# Altium project 2011_bms_slave.PrjPcb
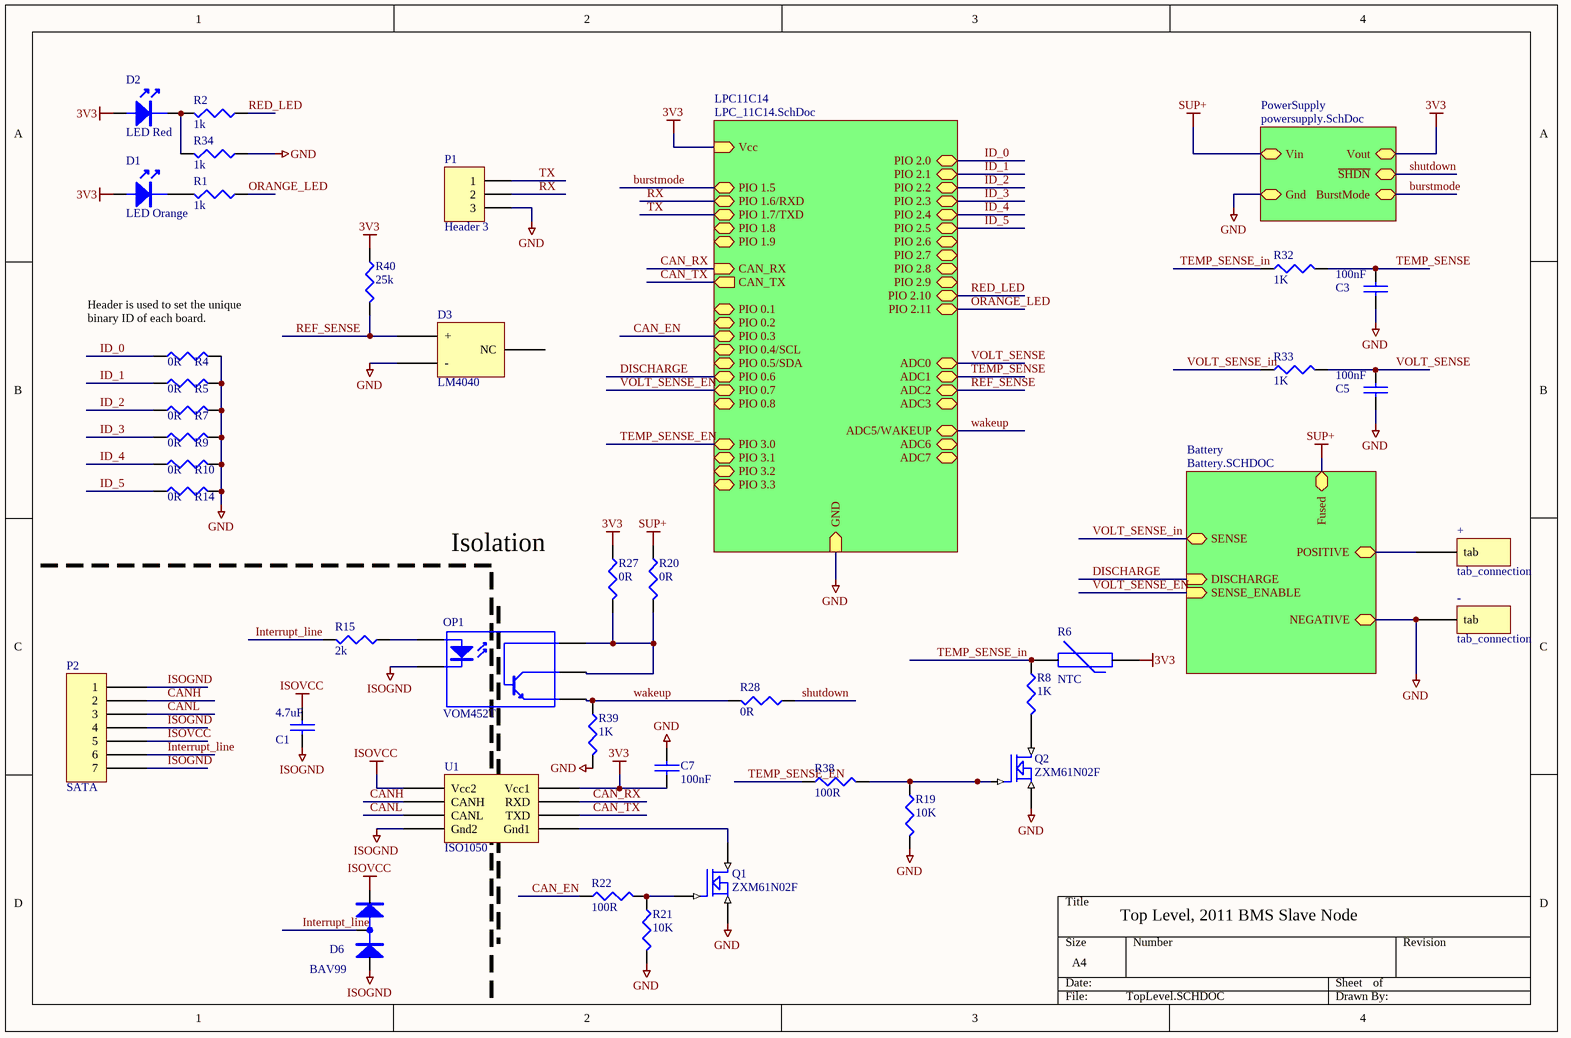
[diagram p0: TopLevel.SCHDOC]
4 sheets, 77 parts. Net scope: hierarchical (ports join the sheet entries above them; power ports are global).
Board file: 2011_bms_slave_board.PcbDoc
Sheets:
  TopLevel.SCHDOC
    Battery = Battery.SCHDOC
    LPC11C14 = LPC_11C14.SchDoc
    PowerSupply = powersupply.SchDoc

## Sheet TopLevel.SCHDOC
size A4

### Parts
+  tab_connection  [tab_connect]
-  tab_connection  [tab_connect]
C1  4.7uF  [0805]
C3  100nF  [0603]
C5  100nF  [0603]
C7  100nF  [0603]
D1  LED Orange  [0603_LED]
D2  LED Red  [0603_LED]
D3  LM4040  [SOT23-3]
D6  BAV99  [BAV99]
OP1  VOM452T  [VOM452T]
P1  Header 3  [HDR1X3]
P2  SATA  [47080-4005-SATA]
Q1  ZXM61N02F  [SOT23-3]
Q2  ZXM61N02F  [SOT23-3]
R1  1k  [0603]
R2  1k  [0603]
R4  0R  [0603]
R5  0R  [0603]
R6  NTC  [MHDR1X2]
R7  0R  [0603]
R8  1K  [0603]
R9  0R  [0603]
R10  0R  [0603]
R14  0R  [0603]
R15  2k  [0603]
R19  10K  [0603]
R20  0R  [0603]
R21  10K  [0603]
R22  100R  [0603]
R27  0R  [0603]
R28  0R  [0603]
R32  1K  [0603]
R33  1K  [0603]
R34  1k  [0603]
R38  100R  [0603]
R39  1K  [0603]
R40  25k  [0603]
U1  ISO1050  [SOP8]

### Sub-sheets
Battery = Battery.SCHDOC: DISCHARGE (in), SENSE_ENABLE (in), SENSE (bidir), Fused, POSITIVE, NEGATIVE
LPC11C14 = LPC_11C14.SchDoc: ADC5/WAKEUP (bidir), ADC6 (bidir), CAN_TX (out), CAN_RX (in), ADC7, Vcc (in), GND (in), ADC3 (bidir), ADC2 (bidir), ADC1 (bidir), ADC0 (bidir), PIO 0.4/SCL (bidir), PIO 0.5/SDA (bidir), PIO 0.7 (bidir), PIO 0.6 (bidir), PIO 0.1 (bidir), PIO 0.2, PIO 0.3, PIO 0.8, PIO 1.6/RXD (bidir), PIO 1.7/TXD (bidir), PIO 1.5, PIO 1.8, PIO 1.9, PIO 3.0 (bidir), PIO 3.1 (bidir), PIO 3.2, PIO 3.3, PIO 2.9 (bidir), PIO 2.8 (bidir), PIO 2.7 (bidir), PIO 2.11 (bidir), PIO 2.10 (bidir), PIO 2.3 (bidir), PIO 2.2 (bidir), PIO 2.1 (bidir), PIO 2.6, PIO 2.0, PIO 2.4, PIO 2.5
PowerSupply = powersupply.SchDoc: Vin, Vout, Gnd, BurstMode, ~{SHDN}

### Nets
3V3: C7.1 D1.A D2.A R6.2 R27.1 R40.1 U1.1(Vcc1) ; sheet LPC11C14/Vcc, sheet PowerSupply/Vout
GND: -.0(tab) C3.2 C5.2 C7.2 D3.2(-) P1.3 Q1.2(S) Q2.2(S) R4.2 R5.2 R7.2 R9.2 R10.2 R14.2 R19.2 R21.2 R34.1 R39.2 ; sheet Battery/NEGATIVE, sheet LPC11C14/GND, sheet PowerSupply/Gnd
ISOGND: C1.2 D6.A OP1.3(K) P2.1 P2.4 P2.7 U1.5(Gnd2)
ISOVCC: C1.1 D6.K P2.5 U1.8(Vcc2)
SUP+: R20.1 ; sheet Battery/Fused, sheet PowerSupply/Vin
burstmode: sheet LPC11C14/PIO 1.5, sheet PowerSupply/BurstMode
CAN_EN: R22.1 ; sheet LPC11C14/PIO 0.3
CAN_RX: U1.2(RXD) ; sheet LPC11C14/CAN_RX
CAN_TX: U1.3(TXD) ; sheet LPC11C14/CAN_TX
CANH: P2.2 U1.7(CANH)
CANL: P2.3 U1.6(CANL)
DISCHARGE: sheet Battery/DISCHARGE, sheet LPC11C14/PIO 0.6
ID_0: R4.1 ; sheet LPC11C14/PIO 2.0
ID_1: R5.1 ; sheet LPC11C14/PIO 2.1
ID_2: R7.1 ; sheet LPC11C14/PIO 2.2
ID_3: R9.1 ; sheet LPC11C14/PIO 2.3
ID_4: R10.1 ; sheet LPC11C14/PIO 2.4
ID_5: R14.1 ; sheet LPC11C14/PIO 2.5
Interrupt_line: D6.C P2.6 R15.2
ORANGE_LED: R1.1 ; sheet LPC11C14/PIO 2.11
RED_LED: R2.1 ; sheet LPC11C14/PIO 2.10
REF_SENSE: D3.1(+) R40.2 ; sheet LPC11C14/ADC2
RX: P1.2 ; sheet LPC11C14/PIO 1.6/RXD
shutdown: R28.1 ; sheet PowerSupply/~{SHDN}
TEMP_SENSE: C3.1 R32.2 ; sheet LPC11C14/ADC1
TEMP_SENSE_EN: R38.1 ; sheet LPC11C14/PIO 3.0
TEMP_SENSE_in: R6.1 R8.1 R32.1
TX: P1.1 ; sheet LPC11C14/PIO 1.7/TXD
VOLT_SENSE: C5.1 R33.2 ; sheet LPC11C14/ADC0
VOLT_SENSE_EN: sheet Battery/SENSE_ENABLE, sheet LPC11C14/PIO 0.7
VOLT_SENSE_in: R33.1 ; sheet Battery/SENSE
wakeup: OP1.4(E) R28.2 R39.1 ; sheet LPC11C14/ADC5/WAKEUP
Net+_0: +.0(tab) ; sheet Battery/POSITIVE
NetD1_K: D1.K R1.2
NetD2_K: D2.K R2.2 R34.2
NetOP1_1: OP1.1(A) R15.1
NetOP1_5: OP1.5(C) OP1.6(C) R20.2 R27.2
NetQ1_1: Q1.1(G) R21.1 R22.2
NetQ1_3: Q1.3(D) U1.4(Gnd1)
NetQ2_1: Q2.1(G) R19.1 R38.2
NetQ2_3: Q2.3(D) R8.2

Not connected (* = marked no-connect by the designer): D3 3(NC)

### Notes on the sheet
- (near R4) Header is used to set the unique binary ID of each board.
- (near R27) Isolation
- Top Level, 2011 BMS Slave Node

### Library data of the parts
C1 = CAP: Capacitor; Value: 100nF; Needed?: NO - HW LAB
C3 C5 C7 = CAP: Capacitor; Needed?: NO - HW LAB; Value: 100nF
D1 = LED: Order#: 3225148; Price: 0.99; Supplier: Farnell
D2 = LED: Order#: 5790840; Price: 0.385; Supplier: Farnell
D6 = DIODE SERIES 2: diode, series connected; Order#: 741-000; Price: 0.223; Supplier: Farnell
P1 = Header 3: Header, 3-Pin; LatestRevisionDate: 17-Jul-2002; LatestRevisionNote: Re-released for DXP Platform.; Publisher: Altium Limited
Q1 Q2 = ZXM61N02F: 1.7A, 20V N-Channel Enhancement mode FET; Order#: 9525270; Price: 0.803; Supplier: Farnell
R1 R2 R4 R5 R7 R9 R10 R14 R19 R21 R22 R34 R38 = RES1: Resistor; Order#: 9233253; Price: 0.088; Supplier: Farnell
R6 = NTC: Thermistor, NTC; Order#: 1187036; Supplier: Farnell; Price: 2.23
R8 R15 R20 R27 R28 R32 R33 R39 R40 = RES1: Resistor; Order#: 9330380; Supplier: Farnell; Price: 0.066

## Sheet Battery.SCHDOC
size A4
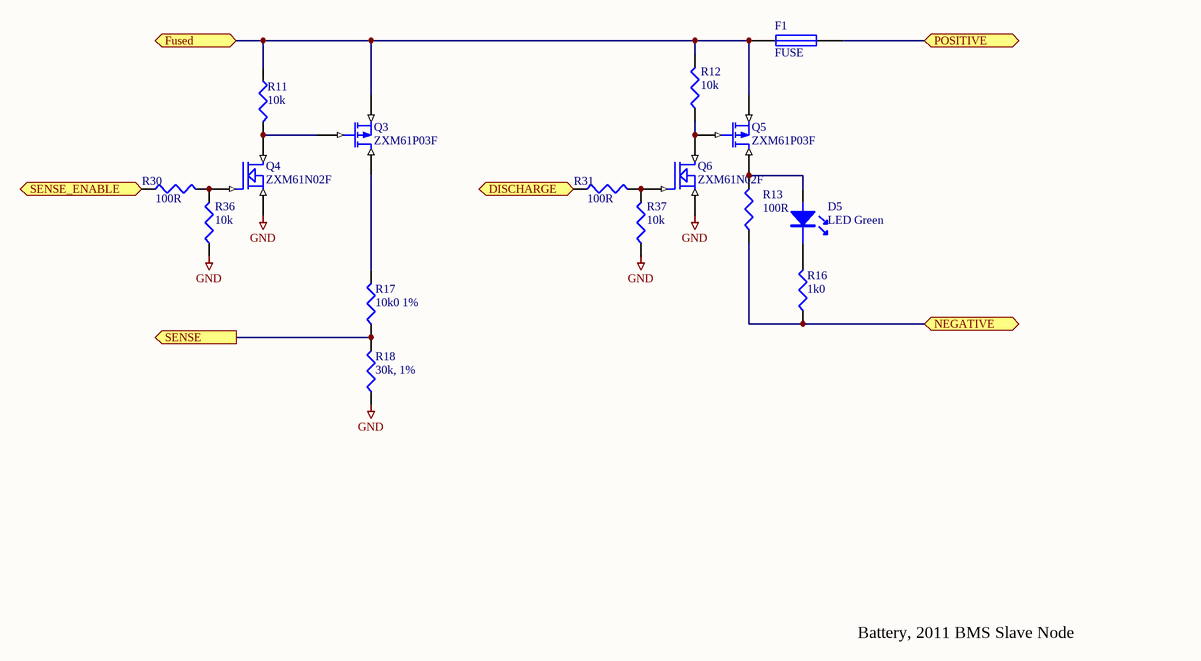
[diagram p1: Battery.SCHDOC]

### Parts
D5  LED Green  [0603_LED]
F1  FUSE  [LITTELFUSE-154]
Q3  ZXM61P03F  [SOT23-3]
Q4  ZXM61N02F  [SOT23-3]
Q5  ZXM61P03F  [SOT23-3]
Q6  ZXM61N02F  [SOT23-3]
R11  10k  [0603]
R12  10k  [0603]
R13  100R  [AXIAL-0.3]  (value not drawn)
R16  1k0  [0603]
R17  10k0 1%  [0603]
R18  30k, 1%  [0603]
R30  100R  [0603]
R31  100R  [0603]
R36  10k  [0603]
R37  10k  [0603]

### Ports
DISCHARGE (in), Fused, NEGATIVE (bidir), POSITIVE (bidir), SENSE (out), SENSE_ENABLE (in)

### Nets
GND: Q4.2(S) Q6.2(S) R13.1 R16.1 R18.1 R36.1 R37.1 ; port NEGATIVE
SUP+: F1.1 Q3.2(D) Q5.2(D) R11.1 R12.2 ; port Fused
DISCHARGE: R31.1 ; port DISCHARGE
VOLT_SENSE_EN: R30.1 ; port SENSE_ENABLE
VOLT_SENSE_in: R17.1 R18.2 ; port SENSE
Net+_0: F1.2 ; port POSITIVE
NetD5_A: D5.A Q5.3(S) R13.2
NetD5_K: D5.K R16.2
NetQ3_1: Q3.1(G) Q4.3(D) R11.2
NetQ3_3: Q3.3(S) R17.2
NetQ4_1: Q4.1(G) R30.2 R36.2
NetQ5_1: Q5.1(G) Q6.3(D) R12.1
NetQ6_1: Q6.1(G) R31.2 R37.2

### Notes on the sheet
- Battery, 2011 BMS Slave Node

### Library data of the parts
D5 = LED: HSMG-C170, Green LED; Order#: 5790852; Price: 0.462; Supplier: Farnell
F1 = FUSE: Order#: 9943625; Supplier: Farnell; Price: 5.25
Q3 Q5 = ZXM61P03F: 1.1A, 30V P-Channel Enhancement mode FET; Order#: 9525300; Price: 0.825; Supplier: Farnell
Q4 Q6 = ZXM61N02F: as Q1 on sheet TopLevel; Price: 0.803; Supplier: Farnell
R11 R12 R18 = RES1: Resistor; Order#: 9330399; Price: 0.066; Supplier: Farnell
R13 = RES1: Resistor, 100R, 1W, 10V; Order#: 1107496; Price: 2.45; Supplier: Farnell
R16 = RES1: Resistor; Order#: 9330380; Price: 0.066; Supplier: Farnell
R17 = RES1: Resistor; Order#: 9330771; Price: 0.066; Supplier: Farnell
R30 R31 R36 R37 = RES1: Resistor; Order#: 9233253; Price: 0.088; Supplier: Farnell

## Sheet LPC_11C14.SchDoc
size A4; Organization: UNSW Solar Racing Team; Address3: UNSW; Address4: Sydney NSW 2052; Address2: Electrical Engineering; Address1: Rm 109
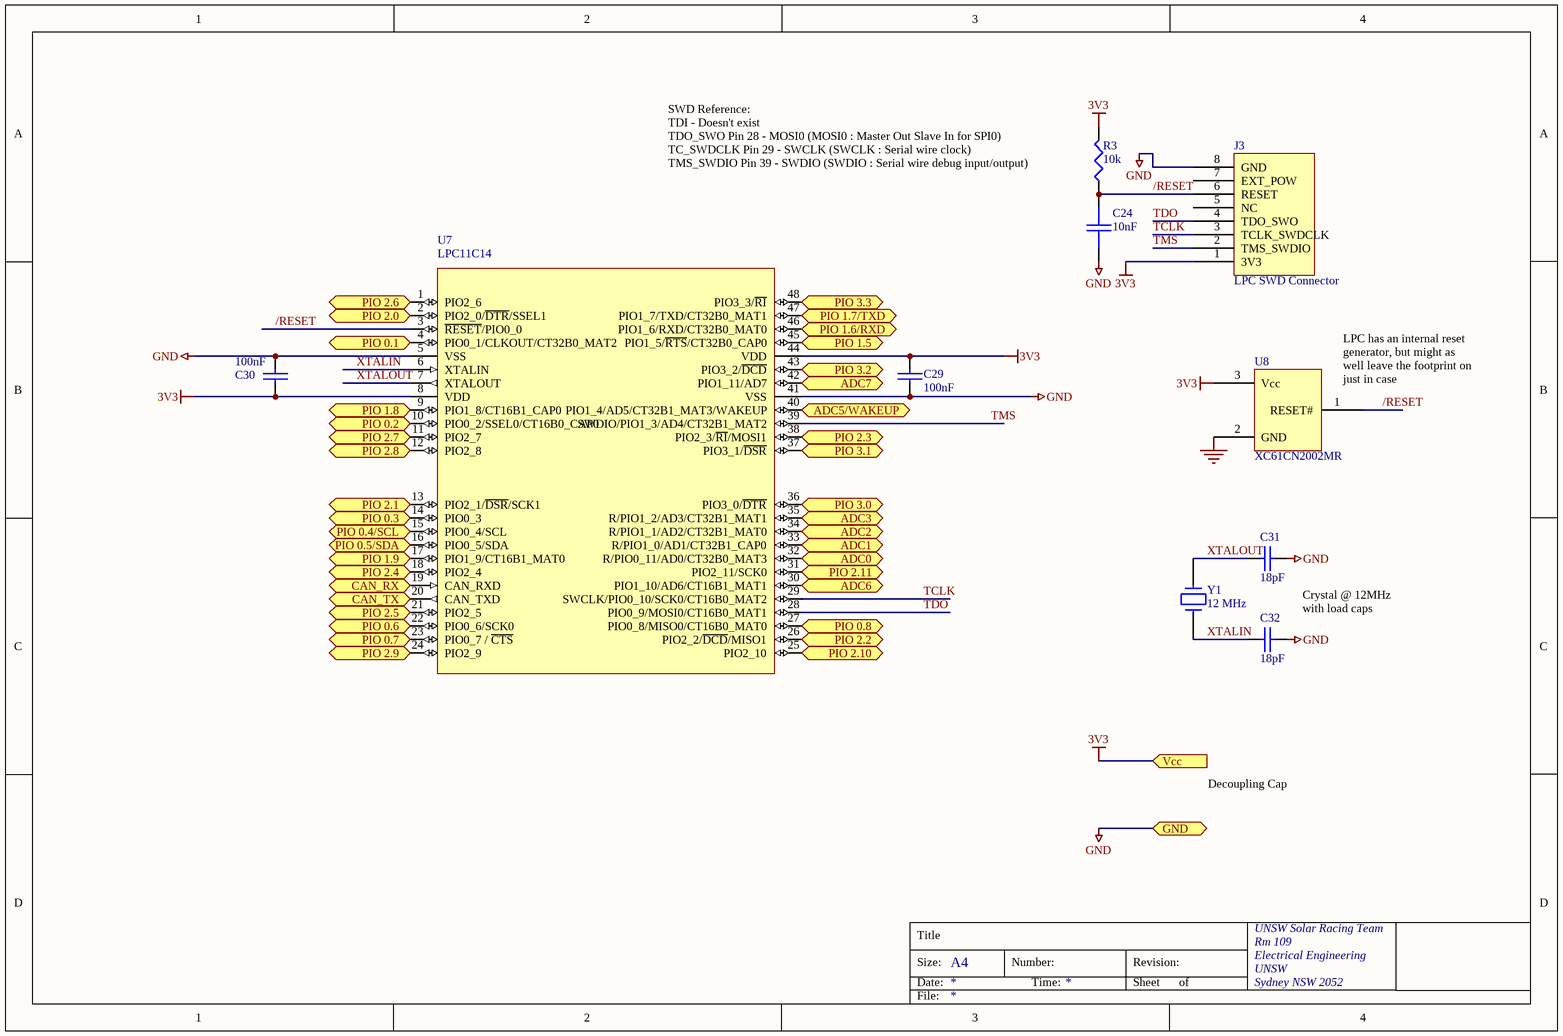
[diagram p2: LPC_11C14.SchDoc]

### Parts
C24  10nF  [0603]
C29  100nF  [0603]
C30  100nF  [0603]
C31  18pF  [0603]
C32  18pF  [0603]
J3  LPC SWD Connector  [IDC8]
R3  10k  [0603]
U7  LPC11C14  [QFP48-long]
U8  XC61CN2002MR  [SOT23-3]
Y1  12 MHz  [HC49/4H]

### Ports
ADC0 (in), ADC1 (in), ADC2 (in), ADC3 (in), ADC5/WAKEUP (in), ADC6 (in), ADC7 (in), CAN_RX (in), CAN_TX (out), GND, PIO 0.1 (bidir), PIO 0.2 (bidir), PIO 0.3 (bidir), PIO 0.4/SCL (bidir), PIO 0.5/SDA (bidir), PIO 0.6 (bidir), PIO 0.7 (bidir), PIO 0.8 (bidir), PIO 1.5 (bidir), PIO 1.6/RXD (bidir), PIO 1.7/TXD (bidir), PIO 1.8 (bidir), PIO 1.9 (bidir), PIO 2.0 (bidir), PIO 2.1 (bidir), PIO 2.2 (bidir), PIO 2.3 (bidir), PIO 2.4 (bidir), PIO 2.5 (bidir), PIO 2.6 (bidir), PIO 2.7 (bidir), PIO 2.8 (bidir), PIO 2.9 (bidir), PIO 2.10 (bidir), PIO 2.11 (bidir), PIO 3.0 (bidir), PIO 3.1 (bidir), PIO 3.2 (bidir), PIO 3.3 (bidir), Vcc

### Nets
3V3: C29.1 C30.2 J3.1(3V3) R3.2 U7.8(VDD) U7.44(VDD) U8.3(Vcc) ; port Vcc
GND: C24.2 C29.2 C30.1 C31.2 C32.2 J3.8(GND) U7.5(VSS) U7.41(VSS) U8.2(GND) ; port GND
/RESET: C24.1 J3.6(RESET) R3.1 U7.3(~{RESET}/PIO0_0) U8.1(RESET#)
burstmode: U7.45(PIO1_5/~{RTS}/CT32B0_CAP0) ; port PIO 1.5
CAN_EN: U7.14(PIO0_3) ; port PIO 0.3
CAN_RX: U7.19(CAN_RXD) ; port CAN_RX
CAN_TX: U7.20(CAN_TXD) ; port CAN_TX
DISCHARGE: U7.22(PIO0_6/SCK0) ; port PIO 0.6
ID_0: U7.2(PIO2_0/~{DTR}/SSEL1) ; port PIO 2.0
ID_1: U7.13(PIO2_1/~{DSR}/SCK1) ; port PIO 2.1
ID_2: U7.26(PIO2_2/~{DCD}/MISO1) ; port PIO 2.2
ID_3: U7.38(PIO2_3/~{RI}/MOSI1) ; port PIO 2.3
ID_4: U7.18(PIO2_4) ; port PIO 2.4
ID_5: U7.21(PIO2_5) ; port PIO 2.5
ORANGE_LED: U7.31(PIO2_11/SCK0) ; port PIO 2.11
RED_LED: U7.25(PIO2_10) ; port PIO 2.10
REF_SENSE: U7.34(R/PIO1_1/AD2/CT32B1_MAT0) ; port ADC2
RX: U7.46(PIO1_6/RXD/CT32B0_MAT0) ; port PIO 1.6/RXD
TCLK: J3.3(TCLK_SWDCLK) U7.29(SWCLK/PIO0_10/SCK0/CT16B0_MAT2)
TDO: J3.4(TDO_SWO) U7.28(PIO0_9/MOSI0/CT16B0_MAT1)
TEMP_SENSE: U7.33(R/PIO1_0/AD1/CT32B1_CAP0) ; port ADC1
TEMP_SENSE_EN: U7.36(PIO3_0/~{DTR}) ; port PIO 3.0
TMS: J3.2(TMS_SWDIO) U7.39(SWDIO/PIO1_3/AD4/CT32B1_MAT2)
TX: U7.47(PIO1_7/TXD/CT32B0_MAT1) ; port PIO 1.7/TXD
VOLT_SENSE: U7.32(R/PIO0_11/AD0/CT32B0_MAT3) ; port ADC0
VOLT_SENSE_EN: U7.23(PIO0_7_/_~{CTS}) ; port PIO 0.7
wakeup: U7.40(PIO1_4/AD5/CT32B1_MAT3/WAKEUP) ; port ADC5/WAKEUP
XTALIN: C32.1 U7.6(XTALIN) Y1.1
XTALOUT: C31.1 U7.7(XTALOUT) Y1.2
NetU7_1: U7.1(PIO2_6) ; port PIO 2.6
NetU7_4: U7.4(PIO0_1/CLKOUT/CT32B0_MAT2) ; port PIO 0.1
NetU7_9: U7.9(PIO1_8/CT16B1_CAP0) ; port PIO 1.8
NetU7_10: U7.10(PIO0_2/SSEL0/CT16B0_CAP0) ; port PIO 0.2
NetU7_11: U7.11(PIO2_7) ; port PIO 2.7
NetU7_12: U7.12(PIO2_8) ; port PIO 2.8
NetU7_15: U7.15(PIO0_4/SCL) ; port PIO 0.4/SCL
NetU7_16: U7.16(PIO0_5/SDA) ; port PIO 0.5/SDA
NetU7_17: U7.17(PIO1_9/CT16B1_MAT0) ; port PIO 1.9
NetU7_24: U7.24(PIO2_9) ; port PIO 2.9
NetU7_27: U7.27(PIO0_8/MISO0/CT16B0_MAT0) ; port PIO 0.8
NetU7_30: U7.30(PIO1_10/AD6/CT16B1_MAT1) ; port ADC6
NetU7_35: U7.35(R/PIO1_2/AD3/CT32B1_MAT1) ; port ADC3
NetU7_37: U7.37(PIO3_1/~{DSR}) ; port PIO 3.1
NetU7_42: U7.42(PIO1_11/AD7) ; port ADC7
NetU7_43: U7.43(PIO3_2/~{DCD}) ; port PIO 3.2
NetU7_48: U7.48(PIO3_3/~{RI}) ; port PIO 3.3

Not connected (* = marked no-connect by the designer): J3 5(NC) 7(EXT_POW)

### Notes on the sheet
- SWD Reference:
  TDI - Doesn't exist
  TDO_SWO Pin 28 - MOSI0 (MOSI0 : Master Out Slave In for SPI0)
  TC_SWDCLK Pin 29 - SWCLK (SWCLK : Serial wire clock)
  TMS_SWDIO Pin 39 - SWDIO (SWDIO : Serial wire debug input/output)
- (near U8) LPC has an internal reset generator, but might as well leave the footprint on just in case
- Crystal @ 12MHz with load caps
- Decoupling Cap
- Title
- Size:
- Date:
- A4
- Number:
- Time:
- Revision:
- Sheet
- of
- File:

### Library data of the parts
C24 C29 C30 = CAP: Capacitor; Needed?: NO - HW LAB
  C24: Value: 10nF
  C29 C30: Value: 100nF
C31 C32 = CAP: Capacitor; Needed?: Farnell; Value: 18pF; Farnell: 1844169; Farnell Price: 0.025
J3 = LPCLink_Connector: Needed?: NO - Common
R3 = RES1: Resistor; Needed?: NO - HW LAB; Value: 10k
U7 = LPC11C14_Full: Needed?: Farnell; Farnell: 1812185; Farnell Price: 8.38
U8 = XC61F: SOT23 reset generator; Needed?: Farnell; Farnell: 3605486; Farnell Price: 1.74
Y1 = CRYSTAL: Needed?: RS; RS: 693-8803; RS Price: 0.95

## Sheet powersupply.SchDoc
size A
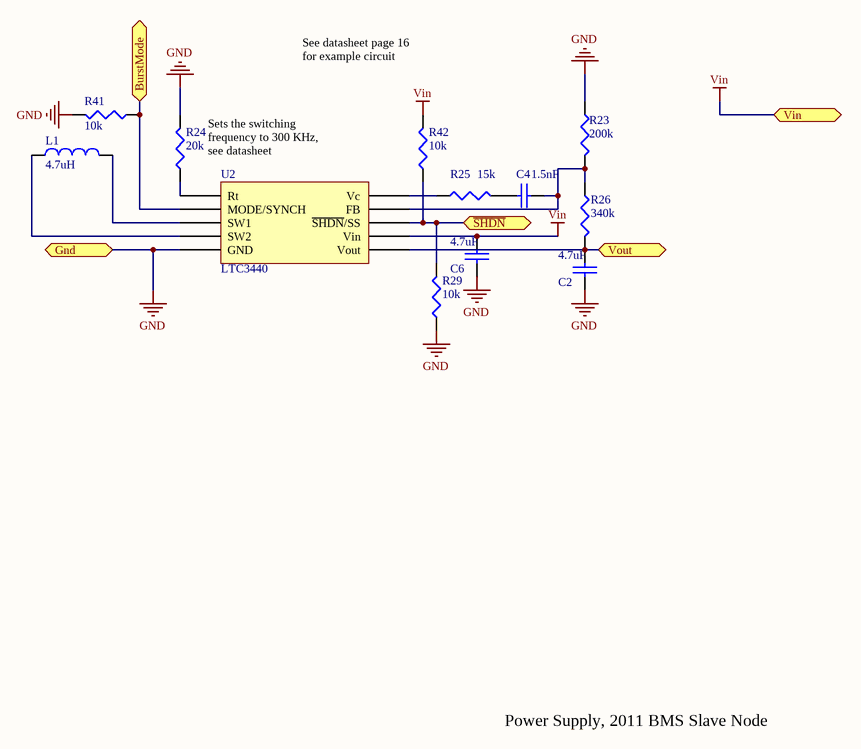
[diagram p3: powersupply.SchDoc]

### Parts
C2  4.7uF  [0805]
C4  1.5nF  [0603]
C6  4.7uF  [0805]
L1  4.7uH  [1812]
R23  200k  [0603]
R24  20k  [0603]
R25  15k  [0603]
R26  340k  [0603]
R29  10k  [0603]
R41  10k  [0603]
R42  10k  [0603]
U2  LTC3440  [MSOP10]

### Ports
BurstMode, Gnd, Vin, Vout, ~{SHDN}

### Nets
3V3: C2.1 R26.2 U2.6(Vout) ; port Vout
GND: C2.2 C6.2 R23.1 R24.2 R29.1 R41.2 U2.5(GND) ; port Gnd
Vin: C6.1 R42.2 U2.7(Vin) ; port Vin  [project net SUP+]
burstmode: R41.1 U2.2(MODE/SYNCH) ; port BurstMode
shutdown: R29.2 R42.1 U2.8(~{SHDN}/SS) ; port ~{SHDN}
NetC4_1: C4.1 R25.2
NetC4_2: C4.2 R23.2 R26.1 U2.9(FB)
NetL1_1: L1.1 U2.4(SW2)
NetL1_2: L1.2 U2.3(SW1)
NetR24_1: R24.1 U2.1(Rt)
NetR25_1: R25.1 U2.10(Vc)

### Notes on the sheet
- See datasheet page 16 for example circuit
- Sets the switching frequency to 300 KHz, see datasheet
- Power Supply, 2011 BMS Slave Node

### Library data of the parts
C2 C4 C6 = CAP: as C1 on sheet TopLevel
L1 = Inductor: Needed?: Not Used; Revision: July-2002: Re-released for DXP Platform.; Value: 4.7uH; Farnell: 1711929; Farnell Price: 0.405
R23-R26 R29 R41 R42 = RES1: Resistor; Order#: 9330399; Price: 0.066; Supplier: Farnell

## Nets that join several sheets
3V3: TopLevel (7 pins), LPC_11C14 (7 pins), powersupply (C2.1 R26.2 U2.6)
GND: TopLevel (18 pins), Battery (7 pins), LPC_11C14 (9 pins), powersupply (7 pins)
SUP+: TopLevel (R20.1), Battery (5 pins), powersupply (C6.1 R42.2 U2.7)
burstmode: LPC_11C14 (U7.45), powersupply (R41.1 U2.2)
CAN_EN: TopLevel (R22.1), LPC_11C14 (U7.14)
CAN_RX: TopLevel (U1.2), LPC_11C14 (U7.19)
CAN_TX: TopLevel (U1.3), LPC_11C14 (U7.20)
DISCHARGE: Battery (R31.1), LPC_11C14 (U7.22)
ID_0: TopLevel (R4.1), LPC_11C14 (U7.2)
ID_1: TopLevel (R5.1), LPC_11C14 (U7.13)
ID_2: TopLevel (R7.1), LPC_11C14 (U7.26)
ID_3: TopLevel (R9.1), LPC_11C14 (U7.38)
ID_4: TopLevel (R10.1), LPC_11C14 (U7.18)
ID_5: TopLevel (R14.1), LPC_11C14 (U7.21)
Net+_0: TopLevel (+.0), Battery (F1.2)
ORANGE_LED: TopLevel (R1.1), LPC_11C14 (U7.31)
RED_LED: TopLevel (R2.1), LPC_11C14 (U7.25)
REF_SENSE: TopLevel (D3.1 R40.2), LPC_11C14 (U7.34)
RX: TopLevel (P1.2), LPC_11C14 (U7.46)
shutdown: TopLevel (R28.1), powersupply (R29.2 R42.1 U2.8)
TEMP_SENSE: TopLevel (C3.1 R32.2), LPC_11C14 (U7.33)
TEMP_SENSE_EN: TopLevel (R38.1), LPC_11C14 (U7.36)
TX: TopLevel (P1.1), LPC_11C14 (U7.47)
VOLT_SENSE: TopLevel (C5.1 R33.2), LPC_11C14 (U7.32)
VOLT_SENSE_EN: Battery (R30.1), LPC_11C14 (U7.23)
VOLT_SENSE_in: TopLevel (R33.1), Battery (R17.1 R18.2)
wakeup: TopLevel (OP1.4 R28.2 R39.1), LPC_11C14 (U7.40)